# Altium project Power_BMS_Rocket.PrjPcb
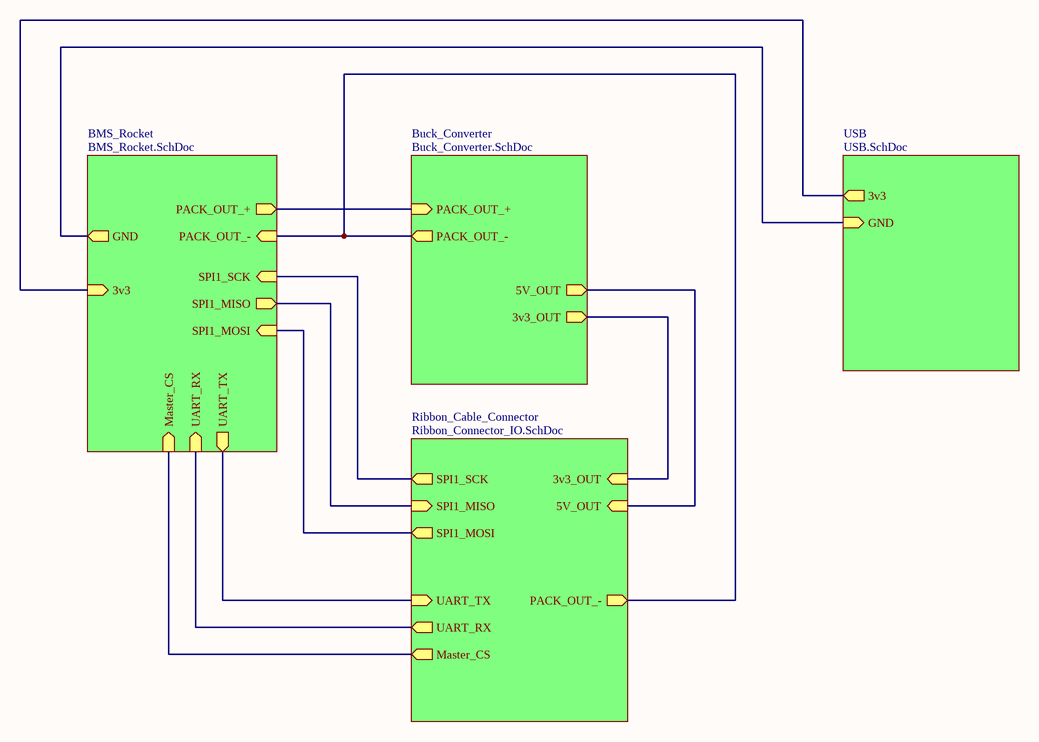
[diagram p0: root.SchDoc]
CAGE_CODE: ?????; CONTRACT_NUMBER: <CONTRACT NO>; DOC_NO_ASSY_DWG: <ASSY DWG NO>; DOC_NO_BOM: <BOM DOC NO>; DOC_NO_FAB_DWG: <FAB DWG NO>; DOC_NO_SCH_DWG: <SCH DWG NO>; PCB_2_DEC_TOL: +/-.01; PCB_3_DEC_TOL: +/-.010; PCB_ANG_TOL: +/-1/2; PCB_ASSEMBLY_NO: <PCB ASSY NO>; PCB_CHECKER: - -----; PCB_CHECKER_APP_DATE: --/--/----; PCB_DESIGNER: - -----; PCB_DESIGNER_APP_DATE: --/--/----; PCB_DWG_NO: <PCB DWG NO>; PCB_ENGINEER: - -----; PCB_ENGINEER_APP_DATE: --/--/----; PCB_PART_NUMBER: <PCB PN>; PCB_REV: A; SCH_REV: A
5 sheets, 97 parts. Net scope: hierarchical (ports join the sheet entries above them; power ports are global).
Board file: Power_BMS.PcbDoc
Sheets:
  root.SchDoc
    BMS_Rocket = BMS_Rocket.SchDoc
    Buck_Converter = Buck_Converter.SchDoc
    Ribbon_Cable_Connector = Ribbon_Connector_IO.SchDoc
    USB = USB.SchDoc

## Sheet root.SchDoc
size A4; SheetNumber: 1; SheetTotal: 5

### Sub-sheets
BMS_Rocket = BMS_Rocket.SchDoc: PACK_OUT_+ (out), PACK_OUT_- (in), SPI1_SCK (in), SPI1_MISO (out), SPI1_MOSI (in), UART_RX (in), UART_TX (out), Master_CS (in), GND (out), 3v3 (in)
Buck_Converter = Buck_Converter.SchDoc: PACK_OUT_- (out), PACK_OUT_+ (in), 3v3_OUT (out), 5V_OUT (out)
Ribbon_Cable_Connector = Ribbon_Connector_IO.SchDoc: SPI1_SCK (out), SPI1_MISO (in), SPI1_MOSI (out), 3v3_OUT (in), 5V_OUT (in), UART_RX (out), UART_TX (in), PACK_OUT_- (out), Master_CS (out)
USB = USB.SchDoc: 3v3 (out), GND (in)

### Nets
+3V3: sheet BMS_Rocket/3v3, sheet USB/3v3
GND: sheet BMS_Rocket/GND, sheet USB/GND
Pack-: sheet BMS_Rocket/PACK_OUT_-, sheet Buck_Converter/PACK_OUT_-, sheet Ribbon_Cable_Connector/PACK_OUT_-
VIN: sheet BMS_Rocket/PACK_OUT_+, sheet Buck_Converter/PACK_OUT_+
3v3_OUT: sheet Buck_Converter/3v3_OUT, sheet Ribbon_Cable_Connector/3v3_OUT
5V_OUT: sheet Buck_Converter/5V_OUT, sheet Ribbon_Cable_Connector/5V_OUT
Master_CS: sheet BMS_Rocket/Master_CS, sheet Ribbon_Cable_Connector/Master_CS
SPI1_CLK: sheet BMS_Rocket/SPI1_SCK, sheet Ribbon_Cable_Connector/SPI1_SCK
SPI1_MISO: sheet BMS_Rocket/SPI1_MISO, sheet Ribbon_Cable_Connector/SPI1_MISO
SPI1_MOSI: sheet BMS_Rocket/SPI1_MOSI, sheet Ribbon_Cable_Connector/SPI1_MOSI
UART_RX: sheet BMS_Rocket/UART_RX, sheet Ribbon_Cable_Connector/UART_RX
UART_TX: sheet BMS_Rocket/UART_TX, sheet Ribbon_Cable_Connector/UART_TX

## Sheet BMS_Rocket.SchDoc
size 431 x 279 mm; SheetNumber: 2; SheetTotal: 5; ENG_APP_DATE: --/--/--; DSN_APP_DATE: --/--/--; CHK_APP_DATE: --/--/--
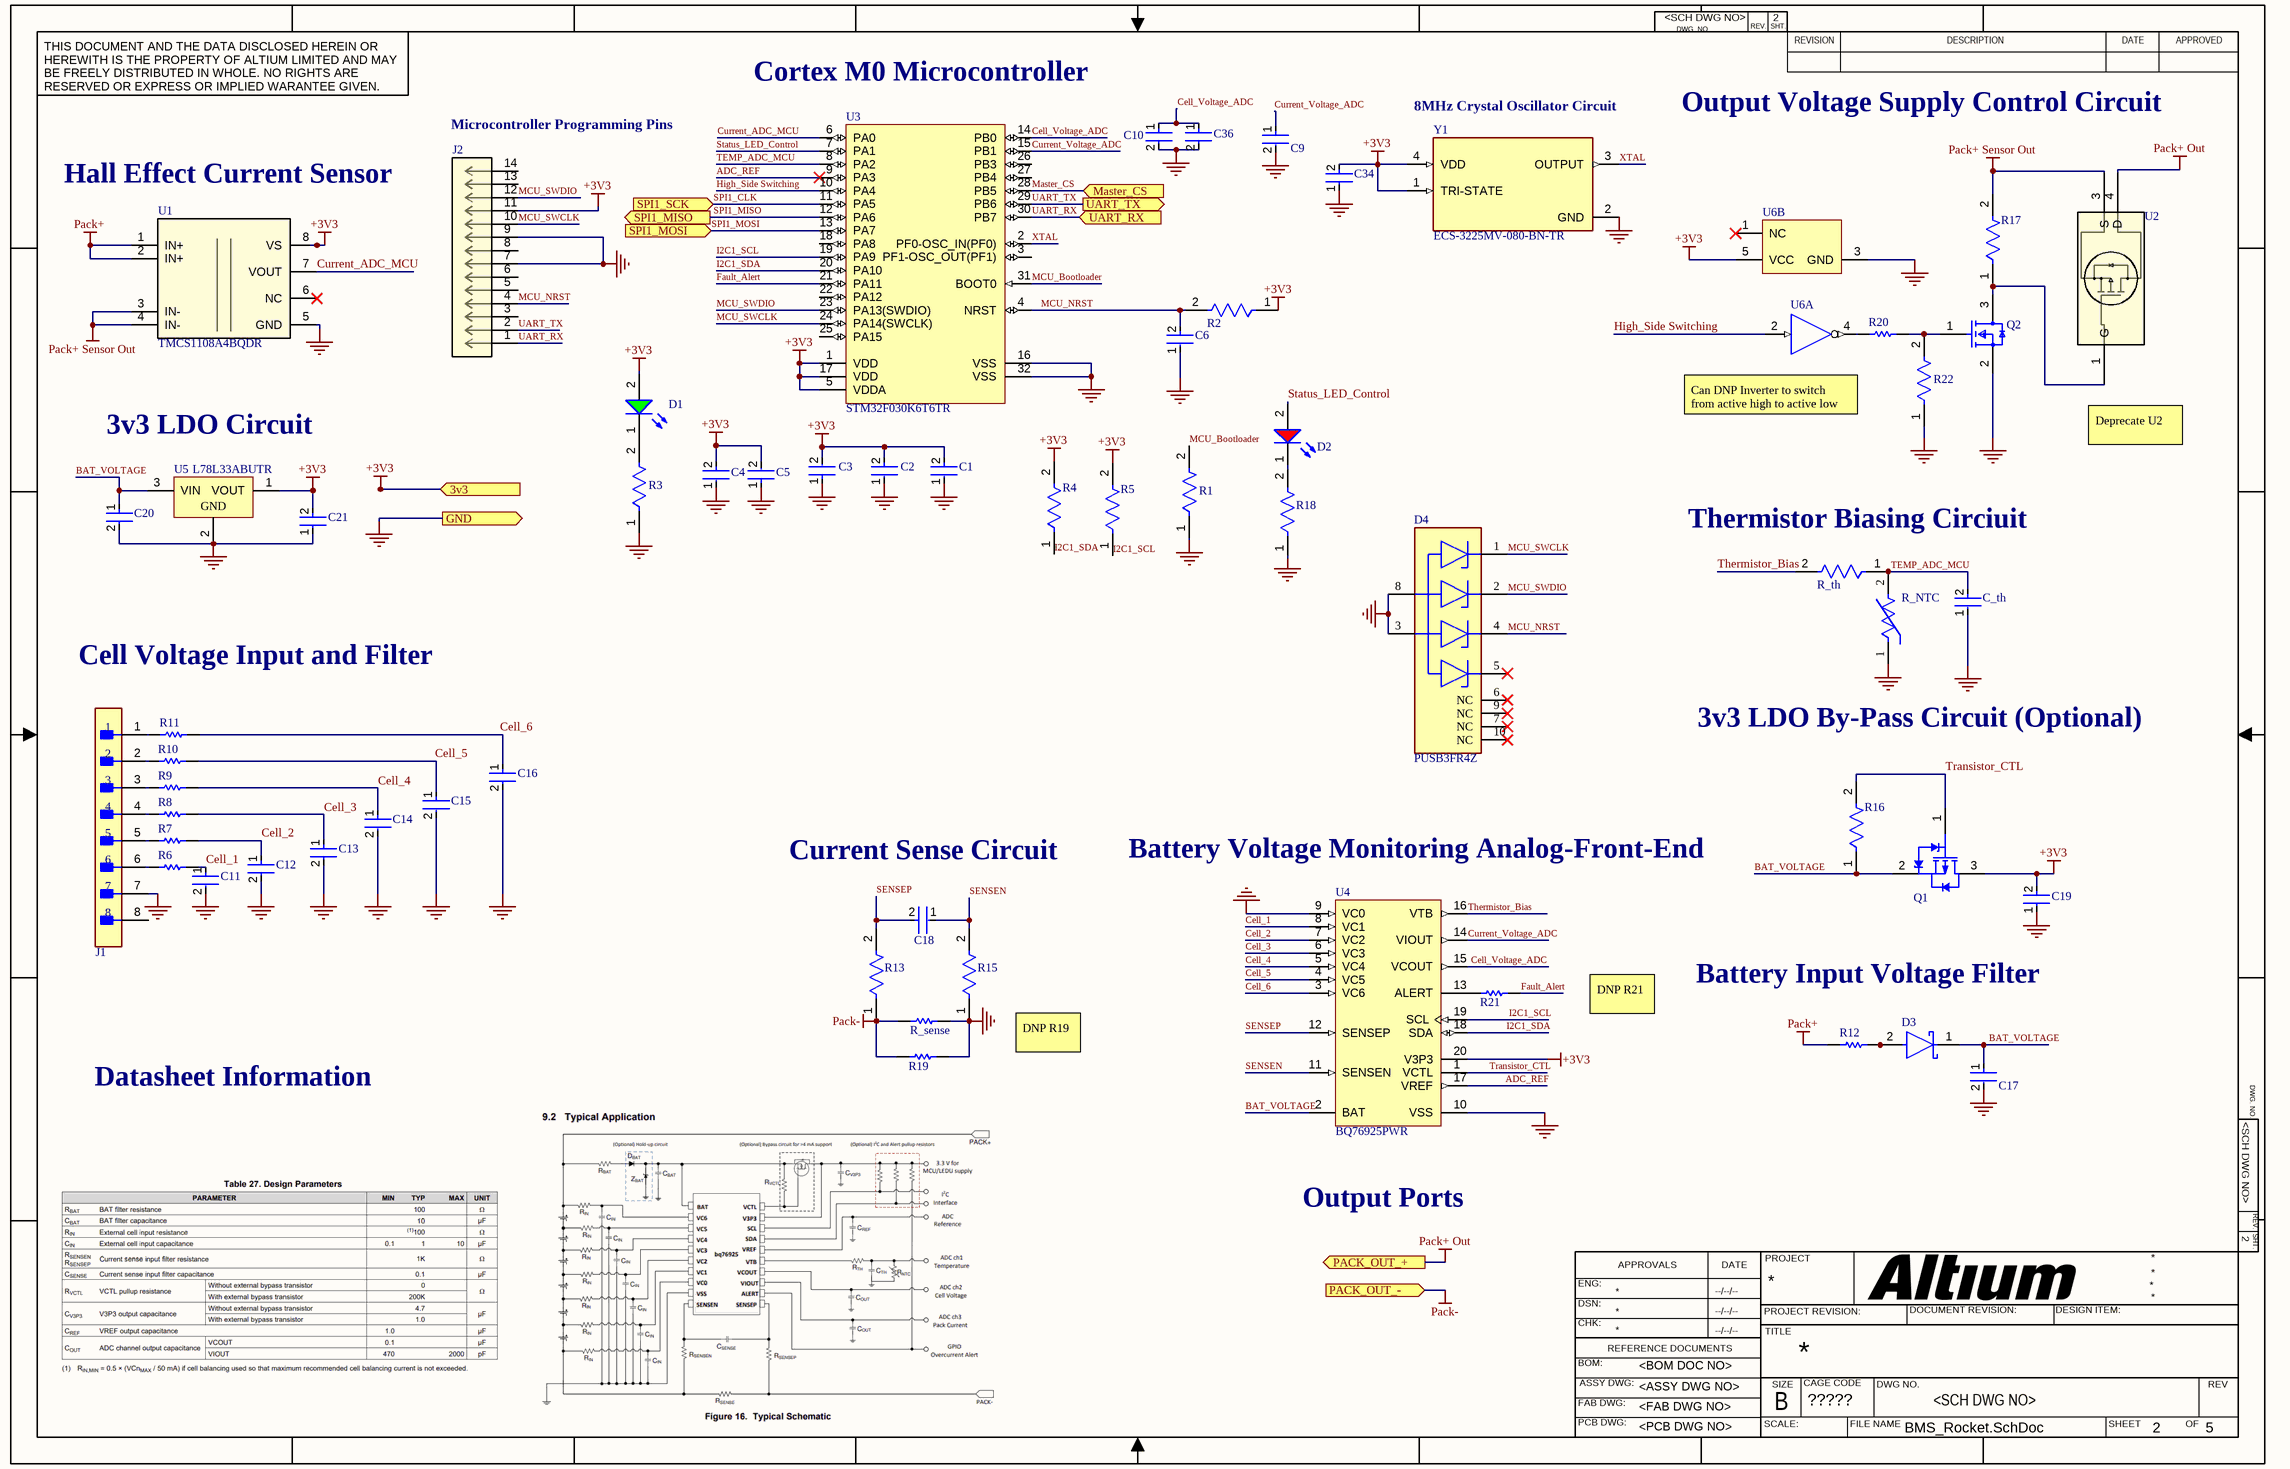
[diagram p1: BMS_Rocket.SchDoc]

### Parts
C1  GRM155R71C104KA88D  [FP-GRM15-MFG]  (value not drawn)
C2  GRM155R71C104KA88D  [FP-GRM15-MFG]  (value not drawn)
C3  GRM188R6YA475KE15D  [FP-GRM188-0_2-IPC_C]  (value not drawn)
C4  C1608X5R1H105K080AB  [FP-C1608-080-0_1-IPC_B]  (value not drawn)
C5  CC0603KRX7R9BB103  [FP-CC0603-DA-MFG]  (value not drawn)
C6  GRM155R71C104KA88D  [FP-GRM15-MFG]  (value not drawn)
C9  GRM1885C1H202JA01D  [FP-GRM188-0_1-e0_2_0_5-IPC_B]  (value not drawn)
C10  CC0402KRX7R8BB102  [FP-CC0402-MFG]  (value not drawn)
C11  UMK107AB7105KA-T  [FP-0603-L_1_6_0_15-W_0_8-IPC_C]  (value not drawn)
C12  UMK107AB7105KA-T  [FP-0603-L_1_6_0_15-W_0_8-IPC_C]  (value not drawn)
C13  UMK107AB7105KA-T  [FP-0603-L_1_6_0_15-W_0_8-IPC_C]  (value not drawn)
C14  UMK107AB7105KA-T  [FP-0603-L_1_6_0_15-W_0_8-IPC_C]  (value not drawn)
C15  UMK107AB7105KA-T  [FP-0603-L_1_6_0_15-W_0_8-IPC_C]  (value not drawn)
C16  UMK107AB7105KA-T  [FP-0603-L_1_6_0_15-W_0_8-IPC_C]  (value not drawn)
C17  C3216X5R1H106M160AB  [FP-C3216-160-0_2-MFG]  (value not drawn)
C18  GRM155R71C104KA88D  [FP-GRM15-MFG]  (value not drawn)
C19  C1608X5R1H105K080AB  [FP-C1608-080-0_1-IPC_B]  (value not drawn)
C20  CGA3E3X7R1H334K080AB  [FP-CGA3E-0_3-0_1-IPC_B]  (value not drawn)
C21  GRM155R71C104KA88D  [FP-GRM15-MFG]  (value not drawn)
C34  GRM155R71C104KA88D  [FP-GRM15-MFG]  (value not drawn)
C36  CC0402KRX7R8BB102  [FP-CC0402-MFG]  (value not drawn)
C_th  GRM155R71C104KA88D  [FP-GRM15-MFG]  (value not drawn)
D1  150060VS75000  [WL-SMCW_0603_150060xx75000]  (value not drawn)
D2  150060SS75000  [WL-SMCW_0603_150060xx75000]  (value not drawn)
D3  B0520LW-7-F  [FP-SOD123-MFG]  (value not drawn)
D4  PUSB3FR4Z  [FP-SOT1176-1-MFG]
J1  M20-9990846  [FP-M20-9990846-MFG]  (value not drawn)
J2  3220-14-0100-00  [CONN14_3220-14_CNC]  (value not drawn)
Q1  BSS84AK,215  [NXP-SOT23_N]  (value not drawn)
Q2  2N7002-7-F  [FP-SOT23-MFG]  (value not drawn)
R1  RC0603FR-0710KL  [FP-RC0603-0_55-IPC_C]  (value not drawn)
R2  RC0603FR-0710KL  [FP-RC0603-0_55-IPC_C]  (value not drawn)
R3  RC0603FR-0710KL  [FP-RC0603-0_55-IPC_C]  (value not drawn)
R4  CRCW06034K70FKEA  [FP-CRCW0603-e3-IPC_A]  (value not drawn)
R5  CRCW06034K70FKEA  [FP-CRCW0603-e3-IPC_A]  (value not drawn)
R6  CRCW0603100RFKEA  [RESC1609X50X30ML8T20]  (value not drawn)
R7  CRCW0603100RFKEA  [RESC1609X50X30ML8T20]  (value not drawn)
R8  CRCW0603100RFKEA  [RESC1609X50X30ML8T20]  (value not drawn)
R9  CRCW0603100RFKEA  [RESC1609X50X30ML8T20]  (value not drawn)
R10  CRCW0603100RFKEA  [RESC1609X50X30ML8T20]  (value not drawn)
R11  CRCW0603100RFKEA  [RESC1609X50X30ML8T20]  (value not drawn)
R12  RK73B1JTTD111J  [RESC1608X55X30NL20T10]  (value not drawn)
R13  AC0603FR-071KL  [FP-AC0603-IPC_B]  (value not drawn)
R15  AC0603FR-071KL  [FP-AC0603-IPC_B]  (value not drawn)
R16  CRCW0603200KFKEA  [FP-CRCW0603-e3-IPC_C]  (value not drawn)
R17  CRCW0603200KFKEA  [FP-CRCW0603-e3-IPC_C]  (value not drawn)
R18  RC0603FR-0710KL  [FP-RC0603-0_55-IPC_C]  (value not drawn)
R19  RC0603JR-070RL  [RESC1608X55X25ML10T15]  (value not drawn)
R20  RK73B1JTTD111J  [RESC1608X55X30NL20T10]  (value not drawn)
R21  RC0603JR-070RL  [RESC1608X55X25ML10T15]  (value not drawn)
R22  RC0603FR-0710KL  [FP-RC0603-0_55-IPC_C]  (value not drawn)
R_NTC  ERT-J1VG103FA  [FP-ERTJ1-MFG]  (value not drawn)
R_sense  RL1220S-R15-F  [RESC2013X50X40LL20T20]  (value not drawn)
R_th  RC0603FR-0710KL  [FP-RC0603-0_55-IPC_C]  (value not drawn)
U1  TMCS1108A4BQDR  [D0008A-IPC_A]
U2  FQD11P06TM  [TO-252-3_ONS]  (value not drawn)
U3  STM32F030K6T6TR  [STM-LQFP32_M]
U4  BQ76925PWR  [PW0020A_L]
U5  L78L33ABUTR  [SOT-89_N]
U6  SN74LVC1G04DCKR  [DCK0005A_N]  (value not drawn)  (parts A,B of 2)
Y1  ECS-3225MV-080-BN-TR  [OSC_ECS-3225MV-080-BN-TR]

### Ports
3v3 (in), GND (out), Master_CS (in), PACK_OUT_+ (out), PACK_OUT_- (in), SPI1_MISO (out), SPI1_MOSI (in), SPI1_SCK (in), UART_RX (in), UART_TX (out)

### Nets
+3V3: C1.2 C2.2 C3.2 C4.2 C5.2 C19.2 C21.2 C34.2 D1.2(A) J2.11 Q1.3(D) R2.1 R4.2 R5.2 U1.8(VS) U3.1(VDD) U3.5(VDDA) U3.17(VDD) U4.20(V3P3) U5.1(VOUT) U6.5(VCC) Y1.1(TRI-STATE) Y1.4(VDD) ; port 3v3
GND: C1.1 C2.1 C3.1 C4.1 C5.1 C6.1 C9.2 C10.2 C11.2 C12.2 C13.2 C14.2 C15.2 C16.2 C17.2 C19.1 C20.2 C21.1 C34.1 C36.2 C_th.1 D4.3(GND) D4.8(GND) J1.7 J2.7 J2.9 Q2.2(S) R1.1 R3.1 R15.1 R18.1 R19.1 R22.1 R_NTC.1 R_sense.1 U1.5(GND) U3.16(VSS) U3.32(VSS) U4.9(VC0) U4.10(VSS) U5.2(GND) U6.3(GND) Y1.2(GND) ; port GND
Pack+: R12.1 U1.1(IN+) U1.2(IN+)
Pack+ Out: U2.4(D) ; port PACK_OUT_+  [project net VIN]
Pack+ Sensor Out: R17.2 U1.3(IN-) U1.4(IN-) U2.3(S)
Pack-: R13.1 R19.2 R_sense.2 ; port PACK_OUT_-
ADC_REF: U3.9(PA3) U4.17(VREF)
BAT_VOLTAGE: C17.1 C20.1 D3.1(C) Q1.2(S) R16.1 U4.2(BAT) U5.3(VIN)
Cell_1: C11.1 R6.2 U4.8(VC1)
Cell_2: C12.1 R7.2 U4.7(VC2)
Cell_3: C13.1 R8.2 U4.6(VC3)
Cell_4: C14.1 R9.2 U4.5(VC4)
Cell_5: C15.1 R10.2 U4.4(VC5)
Cell_6: C16.1 R11.2 U4.3(VC6)
Cell_Voltage_ADC: C10.1 C36.1 U3.14(PB0) U4.15(VCOUT)
Current_ADC_MCU: U1.7(VOUT) U3.6(PA0)
Current_Voltage_ADC: C9.1 U3.15(PB1) U4.14(VIOUT)
Fault_Alert: R21.1 U3.21(PA11)
High_Side Switching: U3.10(PA4) U6.2(A)
I2C1_SCL: R5.1 U3.19(PA9) U4.19(SCL)
I2C1_SDA: R4.1 U3.20(PA10) U4.18(SDA)
Master_CS: U3.28(PB5) ; port Master_CS
MCU_Bootloader: R1.2 U3.31(BOOT0)
MCU_NRST: C6.2 D4.4(CH3) J2.4 R2.2 U3.4(NRST)
MCU_SWCLK: D4.1(CH1) J2.10 U3.24(PA14(SWCLK))
MCU_SWDIO: D4.2(CH2) J2.12 U3.23(PA13(SWDIO))
SENSEN: C18.1 R15.2 U4.11(SENSEN)
SENSEP: C18.2 R13.2 U4.12(SENSEP)
SPI1_CLK: U3.11(PA5) ; port SPI1_SCK
SPI1_MISO: U3.12(PA6) ; port SPI1_MISO
SPI1_MOSI: U3.13(PA7) ; port SPI1_MOSI
Status_LED_Control: D2.2(A) U3.7(PA1)
TEMP_ADC_MCU: C_th.2 R_NTC.2 R_th.1 U3.8(PA2)
Thermistor_Bias: R_th.2 U4.16(VTB)
Transistor_CTL: Q1.1(G) R16.2 U4.1(VCTL)
UART_RX: J2.1 U3.30(PB7) ; port UART_RX
UART_TX: J2.2 U3.29(PB6) ; port UART_TX
XTAL: U3.2(PF0-OSC_IN(PF0)) Y1.3(OUTPUT)
NetD1_1: D1.1(K) R3.2
NetD2_1: D2.1(K) R18.2
NetD3_2: D3.2(A) R12.2
NetJ1_1: J1.1 R11.1
NetJ1_2: J1.2 R10.1
NetJ1_3: J1.3 R9.1
NetJ1_4: J1.4 R8.1
NetJ1_5: J1.5 R7.1
NetJ1_6: J1.6 R6.1
NetQ2_1: Q2.1(G) R20.2 R22.2
NetQ2_3: Q2.3(D) R17.1 U2.1(G)
NetR20_1: R20.1 U6.4(Y)
NetR21_2: R21.2 U4.13(ALERT)

Not connected (* = marked no-connect by the designer): D4 5(CH4)* 6(NC)* 7(NC)* 9(NC)* 10(NC)*; J1 8; J2 3 5 6 8 13 14; U1 6(NC)*; U3 3(PF1-OSC_OUT(PF1)) 18(PA8) 22(PA12) 25(PA15) 26(PB3) 27(PB4); U6 1(NC)*

### Notes on the sheet
- Cortex M0 Microcontroller
- (near J2) Microcontroller Programming Pins
- (near Y1) 8MHz Crystal Oscillator Circuit
- Output Voltage Supply Control Circuit
- Hall Effect Current Sensor
- Can DNP Inverter to switch from active high to active low
- 3v3 LDO Circuit
- Deprecate U2
- (near R_th) Thermistor Biasing Circiuit
- Cell Voltage Input and Filter
- 3v3 LDO By-Pass Circuit (Optional)
- Current Sense Circuit
- (near U4) Battery Voltage Monitoring Analog-Front-End
- DNP R21
- Battery Input Voltage Filter
- Datasheet Information
- DNP R19
- Output Ports
- DWG. NO.
- REV.
- SHT.
- THIS DOCUMENT AND THE DATA DISCLOSED HEREIN OR HEREWITH IS THE PROPERTY OF ALTIUM LIMITED AND MAY BE FREELY DISTRIBUTED IN WHOLE. NO RIGHTS ARE RESERVED OR EXPRESS OR IMPLIED WARANTEE GIVEN.
- REVISION
- DESCRIPTION
- DATE
- APPROVED
- ENG:
- APPROVALS
- PROJECT
- DSN:
- CHK:
- REFERENCE DOCUMENTS
- PROJECT REVISION:
- TITLE
- DOCUMENT REVISION:
- DESIGN ITEM:
- BOM:
- FAB DWG:
- PCB DWG:
- ASSY DWG:
- SCALE:
- SIZE
- B
- CAGE CODE
- FILE NAME
- DWG NO.
- SHEET
- OF
- REV

### Library data of the parts
C1 C2 C6 C18 C21 C34 = CMP-2100-03641-2: CAP CER 0.1UF 16V X7R 0402; Manufacturer: Murata; Standoff Height: 0mm; Tolerance: 10%; Voltage Rating: 16Vdc; Material: Ceramic; Capacitance: 0.10μF; Value: 0.10μF; RoHS: TRUE; Manufacturer Part Number: GRM155R71C104KA88D; Temperature Characteristic: X7R; Octopart: https://octopart.com/grm155r71c104ka88d-murata-196880; Digikey Description: CAP CER 0.1UF 16V X7R 0402; Device Class L3: Ceramic Capacitors; Height: 0.55mm; ComponentLink2Description: Datasheet; Temperature Range Low: -55°C; Ipc Land Pattern Name: CAPC10050X219; ComponentLink2URL: https://search.murata.co.jp/Ceramy/image/img/A01X/G101/ENG/GRM155R71H471KA01-01A.pdf; Device Class L1: Passive Components; Lead Free: yes; Category: Cap; Package: GRM15; Temperature: -55°C to +125°C; Device Class L2: Capacitors; Temperature Range High: +125°C; Mouser Description: 0402 0.1 uF 16V ±10 % Tolerance X7R SMT Multilayer Ceramic Capacitor
C3 = CMP-2006-02545-2: Chip Multilayer Ceramic Capacitors for General Purpose, 0603, 4.7uF, X5R, 15%, 10%, 35V; Lead Free: Lead Free; Max Operating Temperature: 85°C; Case Code (Imperial): 0603; Capacitance: 4.7uF; Width: 0.8mm; Thickness: 0.031inch; Case Code (Metric): 1608; Min Operating Temperature: -55°C; Voltage Rating (DC): 35V; Dielectric: X5R; Voltage: 35V; Packaging: Tape and Reel; Resistor Type: Ceramic; Weight: 0.000222oz; Mount: Surface Mount; Material: Ceramic; Depth: 0.8mm; Tolerance: 10%; REACH SVHC: No SVHC; Case/Package: 0603; Voltage Rating: 35V; Package Quantity: 4000; Height: 0.8mm; Length: 1.6mm; Termination: SMD/SMT
C4 C19 = CMP-2000-06025-2: Multilayer Ceramic Capacitors 1μF ±10% 50V X5R SMD 0603; Capacitance: 1uF; Lead Free: Lead Free; Height: 0.8mm; Mount: Surface Mount; Radiation Hardening: No; Thickness: 0.035inch; Length: 1.6mm; Max Operating Temperature: 85°C; REACH SVHC: No SVHC; Min Operating Temperature: -55°C; Construction: Flat; RoHS Compliant: Yes; Voltage Rating: 50V; Dielectric: X5R; Packaging: Tape and Reel; Termination: SMD/SMT; Voltage Rating (DC): 50V; Case Code (Imperial): 0603; Voltage: 50V; Width: 0.031inch; Weight: 7.1E-05oz; Depth: 0.8mm; Case Code (Metric): 1608; Series: C; Case/Package: 0603; Tolerance: 10%; Resistor Type: Ceramic; Number of Pins: 2; Dielectric Material: Ceramic; Package Quantity: 1
C5 = CMP-2100-03600-2: CAP CER 10000PF 50V X7R 0603; Manufacturer: YAGEO; Tolerance: 0.1; Material: Ceramic; Temperature Coefficient: 15%; Value: 10 nF; Mouser Description: Multilayer Ceramic Capacitor, CC Series, 0.01 - F, - 10%, X7R, 50 V, 0603 [1608 Metric]; Digikey Description: CAP CER 10000PF 50V X7R 0603; Height: 0.9mm; Category: Cap; Temperature Characteristic: X7R; Footprint Url: http://www.yageo.com/exep/pages/download/literatures/UPY-C_GEN_24.pdf; Lead Free: Yes; Voltage Rating: 50 V; Manufacturer Part Number: CC0603KRX7R9BB103; Temperature: -55°C to +125°C; Device Class L3: Ceramic Capacitors; ComponentLink2Description: Datasheet; Voltage: 50 V; Package: CC0603-DA; Octopart: https://octopart.com/cc0603krx7r9bb103-yageo-192938; Automotive: No; Temperature Range High: +125°C; Temperature Range Low: -55°C; RoHS: TRUE; Device Class L1: Passive Components; ComponentLink2URL: http://www.yageo.com/documents/recent/UPY-GPHC_X7R_6.3V-to-50V_18.pdf; Device Class L2: Capacitors; Capacitance: 10 nF
C9 = CMP-2006-02494-2: Chip Multilayer Ceramic Capacitors for General Purpose, 0603, 2000pF, C0G, 30ppm/°C, 5%, 50V; Capacitance: 2nF; Voltage Rating (DC): 50V; Depth: 0.8mm; Material: Ceramic; Package Quantity: 1; Packaging: Tape and Reel; Case Code (Imperial): 0603; Termination: SMD/SMT; Min Operating Temperature: -55°C; Dielectric: C0G; Tolerance: 5%; Case/Package: 0603; REACH SVHC: No SVHC; Max Operating Temperature: 125°C; Length: 1.6mm; Case Code (Metric): 1608; Voltage: 50V; Lead Free: Lead Free; Thickness: 0.035inch; Height: 0.8mm; Mount: Surface Mount; Radiation Hardening: No; Voltage Rating: 50V; Width: 0.8mm
C10 C36 = CMP-03422-000989-1: CAP CER 1000PF 25V X7R 0402; Manufacturer: YAGEO; Material: Ceramic; Value: 1.0 nF; Temperature Coefficient: 30ppm/°C; Automotive Grade: NA; Tolerance: 0.1; Voltage Rating: 25 V; Automotive: No; Temperature Range High: +125°C; ComponentLink2Description: Datasheet; Device Class L2: Capacitors; Device Class L3: Ceramic Capacitors; Mouser Description: Multilayer Ceramic Capacitors MLCC - SMD/SMT 1.0nF 25V X7R 10%; Digikey Description: CAP CER 1000PF 25V X7R 0402; Package: CC0402; Manufacturer Part Number: CC0402KRX7R8BB102; Octopart: https://octopart.com/cc0402krx7r8bb102-yageo-12885104; Temperature Range Low: -55°C; Device Class L1: Passive Components; Lead Free: Yes; RoHS: TRUE; ComponentLink2URL: http://www.yageo.com/documents/recent/UPY-GP_NP0_16V-to-50V_16.pdf; Temperature Characteristic: X7R; Temperature: -55°C to +125°C; Category: Cap; Footprint Url: http://www.yageo.com/exep/pages/download/literatures/UPY-C_GEN_24.pdf; Height: 0.55mm; Ipc Land Pattern Name: CAPC10050X50; Capacitance: 1.0 nF
C11-C16 = CMP-2000-07531-4: Ceramic Capacitor General Use 1uF ±10% 50V X7R 0603; Series: M; Width: 0.031inch; Mount: Surface Mount; Radiation Hardening: No; Voltage Rating (DC): 50V; Packaging: Tape and Reel; Termination: SMD/SMT; Depth: 0.8mm; Case Code (Metric): 1608; Case Code (Imperial): 0603; Height: 0.8mm; Voltage Rating: 50V; Package Quantity: 1; Halogen Free: Halogen Free; Dielectric: X7R; Min Operating Temperature: -55°C; Length: 1.6mm; Construction: Flat; Tolerance: 10%; Thickness: 0.037inch; Max Operating Temperature: 125°C; Case/Package: 0603; Capacitance: 1uF; RoHS Compliant: Yes
C17 = CMP-08246-006999-1: Multilayer Ceramic Capacitors 10uF ±20% 50V X5R SMD 1206; Depth: 1.6mm; Lead Free: Lead Free; Case Code (Metric): 3216; Tolerance: 20%; Thickness: 0.071inch; REACH SVHC: No SVHC; Capacitance: 10uF; Height: 1.6mm; Length: 3.2mm; Voltage Rating: 50V; Dielectric: X5R; Package Quantity: 1; Series: C; Construction: Flat; Min Operating Temperature: -55°C; Mount: Surface Mount; Case Code (Imperial): 1206; Packaging: Tape and Reel; Radiation Hardening: No; Weight: 0.000571oz; Resistor Type: Ceramic; Voltage Rating (DC): 50V; Dielectric Material: Ceramic; Width: 0.063inch; Max Operating Temperature: 85°C; RoHS Compliant: Yes; Termination: SMD/SMT; Case/Package: 1206
C20 = CMP-08246-003263-1: Cap Ceramic 330nF 50V X7R 10% Pad SMD 0603 +125°C Automotive T/R; Thickness: 0.035inch; Package Quantity: 4000; Weight: 7.1E-05oz; Dielectric: X7R; Height: 0.8mm; Termination: SMD/SMT; Voltage Rating (DC): 50V; Length: 0.063inch; Packaging: Tape and Reel; Width: 0.031inch; Ratings: AEC-Q200; Tolerance: 10%; Min Operating Temperature: -55°C; Capacitance: 330nF; Max Operating Temperature: 125°C; Voltage Rating: 50V; Mount: Surface Mount; RoHS Compliant: Yes; Case Code (Imperial): 0603; Case/Package: 0603; Case Code (Metric): 1608
C_th = CMP-2100-03641-2: CAP CER 0.1UF 16V X7R 0402; Manufacturer: Murata; Standoff Height: 0mm; Tolerance: 10%; Voltage Rating: 16Vdc; Capacitance: 0.10μF; Value: 0.10μF; RoHS: TRUE; Manufacturer Part Number: GRM155R71C104KA88D; Temperature Characteristic: X7R; Octopart: https://octopart.com/grm155r71c104ka88d-murata-196880; Digikey Description: CAP CER 0.1UF 16V X7R 0402; Device Class L3: Ceramic Capacitors; Height: 0.55mm; ComponentLink2Description: Datasheet; Temperature Range Low: -55°C; Ipc Land Pattern Name: CAPC10050X219; ComponentLink2URL: https://search.murata.co.jp/Ceramy/image/img/A01X/G101/ENG/GRM155R71H471KA01-01A.pdf; Device Class L1: Passive Components; Lead Free: yes; Category: Cap; Package: GRM15; Temperature: -55°C to +125°C; Device Class L2: Capacitors; Material: Ceramic; Temperature Range High: +125°C; Mouser Description: 0402 0.1 uF 16V ±10 % Tolerance X7R SMT Multilayer Ceramic Capacitor
D1 = CMP-1426-00006-7: WURTH ELEKTRONIK - 150060VS75000 - LED, Green, SMD, 0603, 30 mA, 2 V, 570 nm; Reverse Voltage: 5V; Power Dissipation: 72mW; Dominant Wavelength: 570nm; Peak Wavelength: 572nm; Forward Current: 100mA; Forward Voltage: 2V; Lens Style: Clear, Rectangular; Test Current: 20mA; Max Junction Temperature (Tj): 95°C; Viewing Angle: 140°; Luminous Intensity: 40mcd; Height: 700µm; Width: 800µm; Length: 1.6mm; Mount: Surface Mount; Min Operating Temperature: -40°C; Max Reverse Voltage (DC): 5V; Case Code (Imperial): 0603; Wavelength: 570nm; Color: Green; REACH SVHC: Unknown; RoHS: Compliant; Max Operating Temperature: 85°C; Packaging: Tape and Reel; Case/Package: 0603; Number of Pins: 2; Case Code (Metric): 1608
D2 = CMP-1426-00004-3: Led, Red, 630 Nm, 1.9 V, 30 Ma, 60 Mcd Rohs Compliant: Yes; Dominant Wavelength: 630nm; Lens Style: Clear, Rectangular; Forward Current: 100mA; Test Current: 20mA; Viewing Angle: 140°; Forward Voltage: 1.9V; Peak Wavelength: 645nm; Max Reverse Voltage (DC): 5V; Luminous Intensity: 60mcd; Color: Red; Height: 700µm; Min Operating Temperature: -40°C; Case Code (Imperial): 0603; REACH SVHC: Unknown; RoHS: Compliant; Length: 1.6mm; Case Code (Metric): 1608; Mount: Surface Mount; Wavelength: 630nm; Packaging: Tape and Reel; Max Operating Temperature: 85°C; Width: 800µm; Case/Package: 0603
D3 = CMP-12790-000026-1: DIODE SCHOTTKY 20V 500MA SOD123; Manufacturer: Diodes Inc.; Max Junction Temp: +125°C; Value: 170pF; Max Surge Forward Current: 5.5A; Forward Current: 0.5A; Standoff Height: 0mm; Peak Reverse Current: 250uA; Octopart: https://octopart.com/b0520lw-7-f-diodes+inc.-325707; Mouser Description: Schottky Diodes & Rectifiers 20V 410mW; ComponentLink2Description: Datasheet; Ipc Land Pattern Name: SOD365155X123-2; Device Class L1: Discrete Semiconductors; Category: Diode; ComponentLink2URL: https://www.diodes.com/assets/Datasheets/ds30051.pdf; Footprint Url: https://www.diodes.com/assets/Package-Files/SOD123.pdf; Package: SOD123; Device Class L3: Schottky Diodes; Digikey Description: DIODE SCHOTTKY 20V 500MA SOD123; Temperature Range Low: -65°C; RoHS: TRUE; Max Repetitive Reverse Voltage: 20V; Lead Free: Yes; Temperature: -65°C to +125°C; Reverse Voltage: 20V; Temperature Range High: +125°C; Capacitance: 170pF; Device Class L2: Diodes; Automotive: No; Height: 1.45mm; Manufacturer Part Number: B0520LW-7-F
D4 = CMP-14432-000005-1: TVS DIODE 3.3VWM 3VC DFN2510A-10; RoHS Compliant: Yes
J1 = CMP-15831-000033-1: CONN HEADER VERT 8POS 2.54MM; Connector Type: Male Pin; Gender: Male; Insulation Resistance: 1GR; Number of Positions: 8; Contact Resistance: 30mR; Current Rating: 3A; Termination: Solder; Case/Package: SIL; RoHS Compliant: Yes; Series: M20; Housing Material: Nylon; Radiation Hardening: No; Package Quantity: 1000; Contact Material: Brass; Contact Plating: Tin; Max Operating Temperature: 105°C; Contact Mating Length: 0.24inch; Depth: 2.54mm; Color: Black; Number of Contacts: 8; Mount: Through Hole; Number of Rows: 1; Packaging: Bulk; Min Operating Temperature: -40°C; Max Current Rating: 3A; REACH SVHC: No SVHC; Pitch: 2.54mm; Housing Color: Black; Orientation: Straight; Length: 20.32mm; Contact Type: Male Pin
J2 = 3220-14-0100-00: No Description Available; Mfr_Name: CNC Tech; Type: Headers, Male Pins; RefDes: RefDes
Q1 = CMP-1259-00086-1: P-Channel Trench MOSFET, -50 V, -0.18 A, -55 to 150 degC, 3-Pin SOT23, Tape and Reel; Manufacturer: NXP Semiconductors; Automotive Qualified: Y; Packing: Tape & Reel; Channel Type: P; VGSth [typ] (V): -1.6; IDM [max] (A): -0.7; Code_JEDEC: TO-236AB; DatasheetVersion: Rev. 1; ID [max] (A): -0.18; Mounting Technology: Surface Mount; ComponentLink3URL: http://www.nxp.com/documents/outline_drawing/sot023_po.pdf; ComponentLink1Description: Manufacturer URL; PackageVersion: 06-03-16, 03/2006; ComponentLink2Description: Datasheet; PackageReference: SOT23; VDS [max] (V): -50; PackageDescription: 3-Pin Small Outline Transistor Package, Body 2.9 x 1.3 mm, Pitch 0.95 mm; ComponentLink2URL: http://www.nxp.com/documents/data_sheet/BSS84AK.pdf; ComponentLink3Description: Package Specification; ComponentLink1URL: http://www.nxp.com/; PartNumber: BSS84AK,215
Q2 = CMP-2000-04929-2: MOSFET N-CH 60V 115MA SOT23-3; Turn-On Delay Time: 7ns; Turn-Off Delay Time: 11ns; Drain to Source Resistance: 7.5R; Rise Time: 3ns; Drain to Source Breakdown Voltage: 70V; Input Capacitance: 50pF; Number of Elements: 1; Power Dissipation: 540mW; Max Power Dissipation: 300mW; Fall Time: 5.6ns; Gate to Source Voltage (Vgs): 20V; Threshold Voltage: 2.5V; Element Configuration: Single; Termination: SMD/SMT; Weight: 0.000282oz; Radiation Hardening: No; Max Operating Temperature: 150°C; On-State Resistance: 7.5R; Mount: Surface Mount; Current Rating: 115mA; Contact Plating: Tin; Lead Free: Lead Free; Min Operating Temperature: -55°C; Number of Pins: 3; REACH SVHC: No SVHC; Drain to Source Voltage (Vdss): 60V; Width: 1.3mm; Package Quantity: 3000; Length: 2.9mm; Case/Package: SOT-23; Number of Channels: 1; Dual Supply Voltage: 60V; Packaging: Tape and Reel; Height: 1mm; Voltage Rating (DC): 60V; Nominal Vgs: 2.5V; Continuous Drain Current (ID): 115mA; Voltage: 60V; Rds On Max: 7.5R
R1-R3 R18 R22 R_th = CMP-2100-03664-2: RES 10K OHM 1% 1/10W 0603; Voltage Rating: 75V; Voltage Rating (DC): 50V; Resistance: 10kR; Power Rating: 100mW; Temperature Coefficient: 100ppm/°C; Depth: 0.8mm; Termination: SMD/SMT; Resistor Type: Thick Film; Series: RC; Construction: Rectangular; Features: Moisture Resistant; Packaging: Tape and Reel; Min Operating Temperature: -55°C; Number of Terminations: 2; Lead Pitch: 0.3mm; RoHS Compliant: Yes; Case/Package: 0603; Resistance Tolerance: 1%; Military Standard: Not; Weight: 7.1E-05oz; Number of Pins: 2; Tolerance: 1%; Length: 1.6mm; Case Code (Imperial): 0603; Lead Free: Lead Free; Width: 0.8mm; Max Power Dissipation: 100mW; Height: 0.45mm; Max Operating Temperature: 155°C; Case Code (Metric): 1608; Size Code: 0603
R4 R5 = CMP-1666-00019-3: RES Thick Film, 4.7kΩ, 1%, 0.1W, 100ppm/°C, 0603; Resistance: 4.7kR; Voltage Rating: 75V; Power Rating: 100mW; Case Code (Metric): 1608; Military Standard: Not; Packaging: Tape and Reel; Termination: SMD/SMT; Temperature Coefficient: 100ppm/°C; Lead Free: Lead Free; Length: 1.55mm; Width: 0.85mm; Height: 0.45mm; Depth: 0.85mm; Weight: 7.1E-05oz; Case Code (Imperial): 0603; Contact Plating: Tin; Case/Package: 0603; Max Operating Temperature: 155°C; Mount: Surface Mount; Tolerance: 1%; Min Operating Temperature: -55°C; Package Quantity: 5000; Voltage Rating (DC): 75V; Composition: Thick Film
R6-R11 = CMP-2000-03824-5: Chip Resistor, 100 Ohm, +/- 1%, 100 mW,-55 to 155 degC, 0603 (1608 Metric), RoHS, Tape and Ree; Manufacturer: Vishay Semiconductor; ComponentLink2URL: http://www.vishay.com/docs/20035/dcrcwe3.pdf; ComponentLink1URL: http://www.vishay.com/; Mounting Technology: Surface Mount; ComponentLink1Description: Manufacturer URL; ComponentLink2Description: Datasheet; PackageDescription: 2-Pin Surface Mount Device, Body 1.575 x 0.85 mm; PackageReference: 0603; DatasheetVersion: 06/2012
R12 R20 = CMP-2000-01856-1: Manufacturer: KOA Speer; Part Number: RK73B1JTTD111J
R13 R15 = CMP-2000-04828-3: RES 1kΩ 1.00% 0.1W 0603; Voltage Rating: 50V; Power Rating: 100mW; Tolerance: 1%; Temperature Coefficient: 100ppm/°C; Resistance: 1kR; Depth: 0.8mm; Case/Package: 0603; Size Code: 0603; Case Code (Metric): 1608; Height: 0.022inch; Series: AC; Width: 0.031inch; Construction: Rectangular; Length: 0.063inch; Case Code (Imperial): 0603; Package Quantity: 1; RoHS Compliant: Yes; Features: Moisture Resistant; Resistor Type: Thick Film; Max Power Dissipation: 100mW; Packaging: Tape and Reel; Termination: SMD/SMT; Ratings: AEC-Q200; Max Operating Temperature: 155°C; Min Operating Temperature: -55°C; Military Standard: Not; Lead Free: Lead Free; Number of Terminations: 2
R16 R17 = CMP-2000-03059-2: RES Thick Film, 200kΩ, 1%, 0.1W, 100ppm/°C, 0603; Resistance: 200kR; Voltage Rating (DC): 75V; Power Rating: 100mW; Termination: SMD/SMT; Depth: 0.85mm; Military Standard: Not; Case Code (Metric): 1608; Composition: Thick Film; Package Quantity: 10; Width: 0.033inch; Voltage Rating: 75V; Features: Automotive AEC-Q200; Max Power Dissipation: 100mW; Height: 0.45mm; Mount: Surface Mount; Max Operating Temperature: 155°C; Weight: 7.1E-05oz; Lead Free: Lead Free; Length: 1.55mm; Radiation Hardening: No; Case/Package: 0603; Packaging: Tape and Reel; Contact Plating: Tin; Min Operating Temperature: -55°C; Working Voltage: 75V; Temperature Coefficient: 100ppm/°C; Case Code (Imperial): 0603; Tolerance: 1%; Number of Terminations: 2
R19 R21 = CMP-2100-03667-1: Chip Resistor, 0 Ohm, +/- 5%, 0.1 W, -55 to 155 degC, 0603 (1608 Metric), RoHS, Tape and Reel; Manufacturer: Yageo; Temperature Coefficient: 200ppm/degreesC; Voltage Rating: 50V; Power Rating: 100mW; Resistance: 0mOhm; Width: 0.8mm; Max Operating Temperature: 155degC; Tolerance: 5%; Package Reference: 0603; Height: 0.45mm; Depth: 0.8mm; Package Description: 2-Pin Surface Mount Device, Body 1.6 x 0.8 mm; Termination: SMD/SMT; Package Quantity: 5000; Case/Package: 0603; Case Code (Imperial): 0603; Radiation Hardening: No; Number of Pins: 2; Length: 1.6mm; Lead Free: LeadFree; Voltage Rating (DC): 50V; Military Standard: Not; Datasheet URL: http://www.yageo.com/NewPortal/yageodocoutput?fileName=/pdf/R-Chip/PYu-RC_Group_51_RoHS_L_5.pdf; Manufacturer URL: http://www.yageo.com/; Packaging: TapeandReel; Case Code (Metric): 1608; Min Operating Temperature: -55degC; Composition: ThickFilm; RoHSCompliant: true; Contact Plating: Tin; Datasheet Version: Rev. 5, 10/2016; REACH SVHC: NoSVHC
R_NTC = CMP-05419-000001-1: THERMISTOR NTC 10KOHM 3380K 0603; Resistance: 10kR; Max Power Dissipation: 100mW; Resistance Tolerance: 1%; Case Code (Imperial): 0603; Height: 0.8mm; Case/Package: 0603; Depth: 0.8mm; Min Operating Temperature: -40°C; Accuracy: 1%; Series: ERT-J; Termination: SMD/SMT; Length: 1.6mm; Number of Pins: 2; Lead Free: Lead Free; Power Rating: 100mW; Package Quantity: 4000; RoHS Compliant: Yes; Max Operating Temperature: 125°C; Width: 800um; REACH SVHC: No SVHC; Packaging: Tape and Reel; Tolerance: 1%; Mount: Surface Mount; Case Code (Metric): 1608; Radiation Hardening: No
R_sense = CMP-2001-03155-1: Manufacturer: Susumu; Part Number: RL1220S-R15-F
U1 = TMCS1108A4BQDR: No Description Available; Mfr_Name: Texas Instruments; TYPE: TYPE; RefDes: RefDes; Supplier 1: Digikey; Supplier Part Number 1: 296-TMCS1108A4BQDRCT-ND
U2 = FQD11P06TM: No Description Available; Mfr_Name: onsemi; RefDes: RefDes; Type: Type
U3 = CMP-0304-00067-2: ARM Cortex-M0 32-bit MCU, 32 KB Flash, 4 KB Internal RAM, 26 I/Os, 32-Pin LQFP, -40 to 85 degC, Tape and Reel; Manufacturer: STMicroelectronics; Operating Frequency(F) (Processor speed) (MHz): 48; I/Os (High Current): 26; FLASH Size (Prog) (kB): 32; Supply Voltage(Vcc) min (V): 2.4; Internal RAM Size (kB): 4; Core: ARM Cortex-M0; Package Reference: LQFP32; Mounting Technology: Surface Mount; ComponentLink2URL: http://www.st.com/st-web-ui/static/active/en/resource/technical/document/datasheet/DM00088500.pdf; ComponentLink1URL: http://www.st.com/; Packing: Tape and Reel; Package Description: 32-Pin Low Profile Quad Flat Package, 7 x 7 mm Body, 0.8 mm Pitch; ComponentLink2Description: Datasheet; ComponentLink1Description: Manufacturer URL; DatasheetVersion: Rev. 2; PartNumber: STM32F030K6T6TR
U4 = CMP-0321-00736-2: Analog Front End for 3 to 6 Series Lithium-Ion Cells, -25 to 85 degC, 20-pin TSSOP (PW), Green (RoHS & no Sb/Br); Manufacturer: Texas Instruments; SubFamily: Lithium Ion Protection; Li-Ion: Y; Lead Acid: N; PackageReference: PW0020A; PackageVersion: revG, Feb-2011; DatasheetVersion: SLUSAM9B; Li-Polymer: Y; PackageDescription: 20-Pin Plastic Thin Small Outline Package 6.5 x 4.4 mm Body ,0.65 mm Pitch; Over Voltage Protection: N; NiCd: N; NiMH: N; PartNumber: BQ76925PWR; Eco-Plan: Green (RoHS & no Sb/Br); Mounting Technology: Surface Mount; ComponentLink1URL: http://www.ti.com/general/docs/lit/getliterature.tsp?genericPartNumber=BQ76925&fileType=pdf; Code_JEDEC: MO-153; ComponentLink1Description: Datasheet
U5 = CMP-0244-00410-1: Positive Voltage Regulator, 3.3V, 4-Pin SOT-89, Tape and Reel; ComponentLink2Description: Datasheet; ComponentLink2URL: http://www.st.com/internet/com/TECHNICAL_RESOURCES/TECHNICAL_LITERATURE/DATASHEET/CD00000446.pdf; DatasheetVersion: 1/02/2011; ComponentLink1Description: Manufacturer URL; PackageVersion: 2011; ComponentLink1URL: http://www.st.com; PackageReference: SOT-89; PackageDescription: 3-Pin SOT-89 Package 1.5 mm Pitch, 4.1 mm Lead Span
U6 = CMP-0859-00252-3: Single Inverter, DCK0005A, LARGE T&R; Manufacturer: Texas Instruments; Input Type: CMOS/TTL; Output Drive (IOL/IOH)(Max)(mA): 32/-32; Sub-Family: Inverting Buffer/Driver; VCC(Min)(V): 1.65; Bits(#): 1; Schmitt Trigger: No; Technology Family: LVC; Rating: Catalog; ICC @ Nom Voltage(Max)(mA): 0.01; tpd @ Nom Voltage(Max)(ns): 7.5,5.2,4.2,3.7; Voltage(Nom)(V): 1.8,2.5,3.3,5; F @ Nom Voltage(Max)(Mhz): 150; Output Type: CMOS; VCC(Max)(V): 5.5; Logic: Inverting; PackageReference: DCK0005A; Generic Part Number: SN74LVC1G04; Operating Temperature Range(C): -40 to 125,-40 to 85; DatasheetVersion: SCES214AD; 3-State Output: No
Y1 = ECS-3225MV-080-BN-TR: 8 MHz XO (Standard) HCMOS Oscillator 1.62V ~ 3.63V Enable/Disable 4-SMD, No Lead; MF: ECS Inc.; SnapEDA_Link: https://www.snapeda.com/parts/ECS-3225MV-080-BN-TR/ECS/view-part/?ref=snap; Package: ECS-3225MV-0-4 ECS; Value: *; MP: ECS-3225MV-080-BN-TR; Check_prices: https://www.snapeda.com/parts/ECS-3225MV-080-BN-TR/ECS/view-part/?ref=eda

## Sheet Buck_Converter.SchDoc
size A4; SheetNumber: 3; SheetTotal: 4
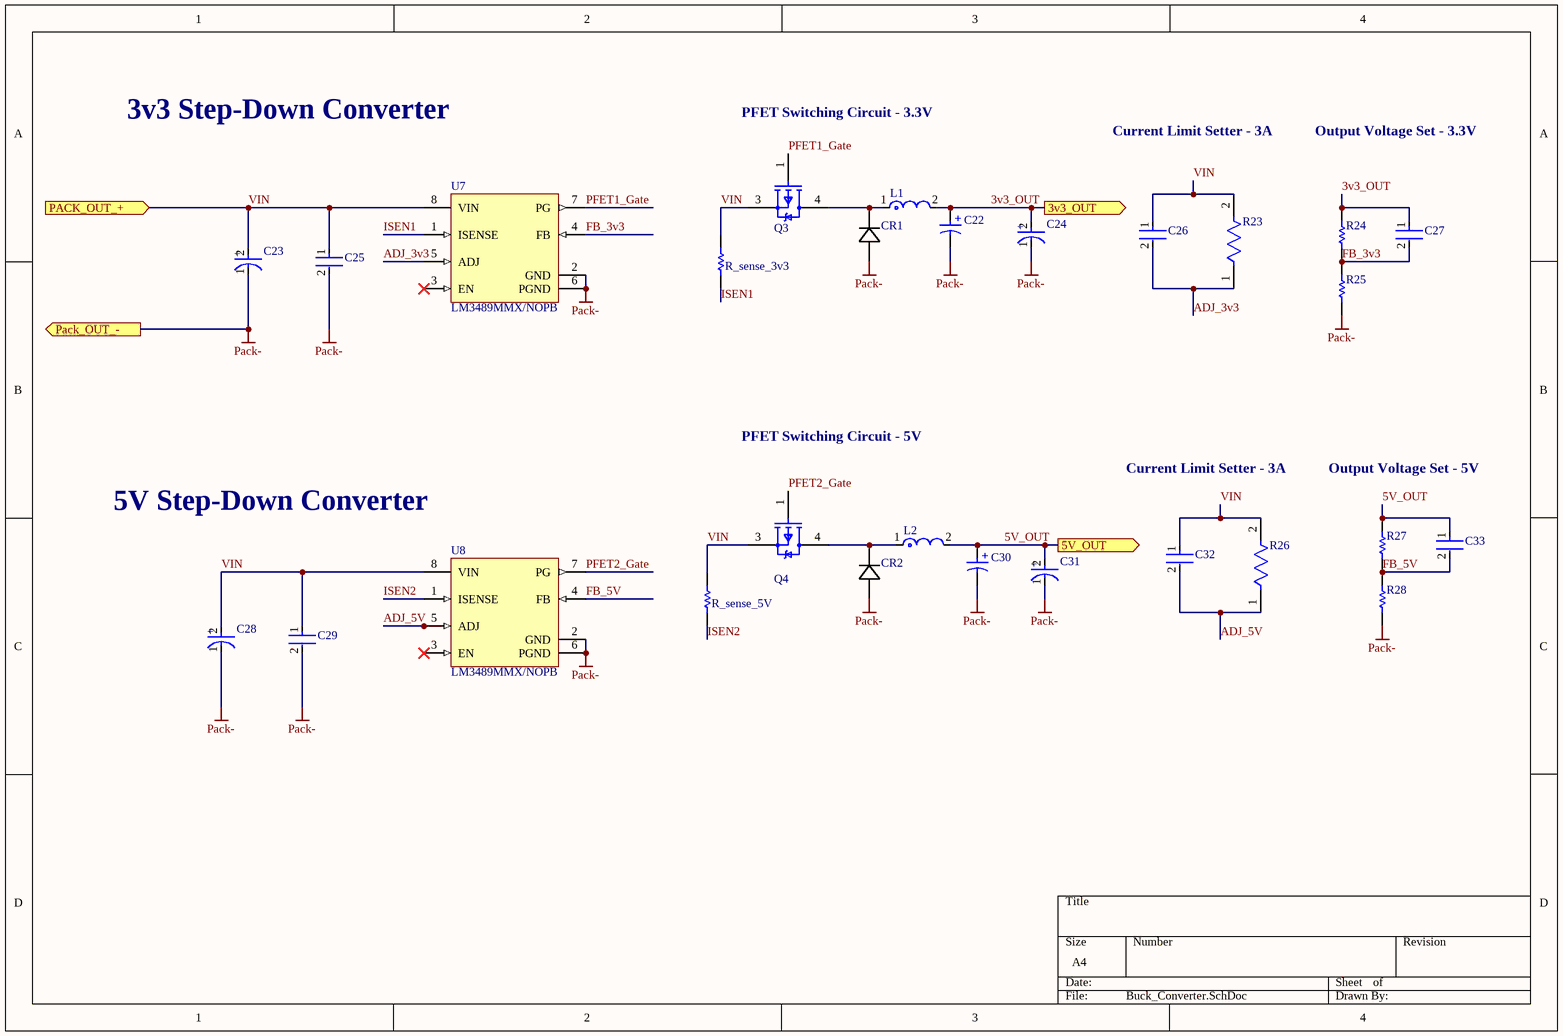
[diagram p2: Buck_Converter.SchDoc]

### Parts
C22  865080545012  [WCAP-ASLI_D6.3H7.7]  (value not drawn)
C23  EEEFK1H220P  [FP-FKD-MFG]  (value not drawn)
C24  EEE-FK1H100UR  [FP-FKC-MFG]  (value not drawn)
C25  C0603C104K5RACTU  [FP-C0603C-CF-MFG]  (value not drawn)
C26  C0603C104M5RACAUTO  [FP-C0603C-CF-MFG]  (value not drawn)
C27  C0603C101J5GACTU  [FP-C0603C-CF-MFG]  (value not drawn)
C28  EEEFK1H220P  [FP-FKD-MFG]  (value not drawn)
C29  C0603C104K5RACTU  [FP-C0603C-CF-MFG]  (value not drawn)
C30  865080545012  [WCAP-ASLI_D6.3H7.7]  (value not drawn)
C31  EEE-FK1H100UR  [FP-FKC-MFG]  (value not drawn)
C32  C0603C104M5RACAUTO  [FP-C0603C-CF-MFG]  (value not drawn)
C33  C0603C101J5GACTU  [FP-C0603C-CF-MFG]  (value not drawn)
CR1  B340AE-13  [CR_SMA_320-340AE_DIO]  (value not drawn)
CR2  B340AE-13  [CR_SMA_320-340AE_DIO]  (value not drawn)
L1  1217AS-H-150M=P3  [FP-DEM8045C-MFG]  (value not drawn)
L2  1217AS-H-150M=P3  [FP-DEM8045C-MFG]  (value not drawn)
Q3  IRFR9024NTRPBF  [FP-PG-TO252-3-MFG]  (value not drawn)
Q4  IRFR9024NTRPBF  [FP-PG-TO252-3-MFG]  (value not drawn)
R23  RMCF0603FT182K  [FP-RMCF0603-MFG]  (value not drawn)
R24  ERA3AEB333V  [RESC1608X55X30ML20T20]  (value not drawn)
R25  ERJ-3EKF2002V  [RESC1608X55X30ML15T15]  (value not drawn)
R26  RMCF0603FT182K  [FP-RMCF0603-MFG]  (value not drawn)
R27  ERA3AEB333V  [RESC1608X55X30ML20T20]  (value not drawn)
R28  CRCW060311K0FKEA  [RESC1609X50X30ML10T20]  (value not drawn)
R_sense_3v3  RL1220S-R15-F  [RESC2013X50X40LL20T20]  (value not drawn)
R_sense_5V  RL1220S-R15-F  [RESC2013X50X40LL20T20]  (value not drawn)
U7  LM3489MMX/NOPB  [DGK0008A_N]
U8  LM3489MMX/NOPB  [DGK0008A_N]

### Ports
3v3_OUT (out), 5V_OUT (out), PACK_OUT_+ (in), Pack_OUT_- (out)

### Nets
Pack-: C22.2(N) C23.1(C) C24.1(C) C25.2 C28.1(C) C29.2 C30.2(N) C31.1(C) CR1.2 CR2.2 R25.1 R28.1 U7.2(GND) U7.6(PGND) U8.2(GND) U8.6(PGND) ; port Pack_OUT_-
VIN: C23.2(A) C25.1 C26.1 C28.2(A) C29.1 C32.1 Q3.3(SOURCE) Q4.3(SOURCE) R23.2 R26.2 R_sense_3v3.1 R_sense_5V.1 U7.8(VIN) U8.8(VIN) ; port PACK_OUT_+
3v3_OUT: C22.1(P) C24.2(A) C27.1 L1.2 R24.2 ; port 3v3_OUT
5V_OUT: C30.1(P) C31.2(A) C33.1 L2.2 R27.2 ; port 5V_OUT
ADJ_3v3: C26.2 R23.1 U7.5(ADJ)
ADJ_5V: C32.2 R26.1 U8.5(ADJ)
FB_3v3: C27.2 R24.1 R25.2 U7.4(FB)
FB_5V: C33.2 R27.1 R28.2 U8.4(FB)
ISEN1: R_sense_3v3.2 U7.1(ISENSE)
ISEN2: R_sense_5V.2 U8.1(ISENSE)
PFET1_Gate: Q3.1(GATE) U7.7(PG)
PFET2_Gate: Q4.1(GATE) U8.7(PG)
NetCR1_1: CR1.1 L1.1 Q3.4(DRAIN)
NetCR2_1: CR2.1 L2.1 Q4.4(DRAIN)

Not connected (* = marked no-connect by the designer): U7 3(EN)*; U8 3(EN)*

### Notes on the sheet
- 3v3 Step-Down Converter
- PFET Switching Circuit - 3.3V
- Current Limit Setter - 3A
- Output Voltage Set - 3.3V
- PFET Switching Circuit - 5V
- 5V Step-Down Converter
- Output Voltage Set - 5V
- (in symbol CMP-2000-06209-2) +
- (in symbol CMP-03913-54202496-1) +
- (in symbol CMP-05427-000030-1) +

### Library data of the parts
C22 C30 = CMP-03913-54202496-1: 865080545012 Cap Aluminum Lytic 100uF 35V 20% (6.3 X 7.7mm) SMD 300mA 2000h 105C T/R; Leakage Current: 35µA; Impedance: 380mΩ; Life (Hours): 2000hours; Capacitance: 100µF; Dissipation Factor: 14%; Insulation Resistance: 1MΩ; ESR (Equivalent Series Resistance): 321.392mΩ; Case/Package: Radial; Packaging: Cut Tape; REACH SVHC: Unknown; Voltage Rating (DC): 35V; Diameter: 6.3mm; Min Operating Temperature: -55°C; Ripple Current: 300mA; Height: 7.7mm; Voltage Rating: 35V; RoHS: Compliant; Width: 6.6mm; Ripple Current (AC): 300mA; NexarPartId: 54202496; Max Operating Temperature: 105°C; Tolerance: 20%; Length: 7.7mm
C23 C28 = CMP-2000-06209-2: CAP ALUM 22UF 20% 50V SMD; Life (Hours): 2000Hour; Ripple Current: 165mA; ESR (Equivalent Series Resistance): 880mR; Dielectric Material: Aluminium; Leakage Current: 3uA; Polarity: Polar; Radiation Hardening: No; Lead Free: Lead Free; Capacitance: 22uF; Package Quantity: 1000; Width: 7.8mm; Length: 5.8mm; Max Operating Temperature: 105°C; Tolerance: 20%; Height - Seated (Max): 0.24inch; Height: 5.8mm; Voltage Rating: 50V; Diameter: 6.3mm; Series: FK; Voltage: 50V; Termination: SMD/SMT; Construction: Cylindrical; Mount: Surface Mount; Number of Pins: 2; Case/Package: Radial; Packaging: Tape and Reel; Ripple Current (AC): 165mA; REACH SVHC: No SVHC; Min Operating Temperature: -55°C; Contact Plating: Tin; Voltage Rating (DC): 50V; RoHS Compliant: Yes; Impedance: 880mR
C24 C31 = CMP-05427-000030-1: CAP ALUM 10UF 20% 50V SMD; Impedance: 1.52R; Ripple Current (AC): 85mA; Life (Hours): 2000Hour; Leakage Current: 3uA; Dielectric Material: Aluminium; Length: 5.8mm; Voltage Rating: 50V; Radiation Hardening: No; Max Operating Temperature: 105°C; REACH SVHC: No SVHC; Tolerance: 20%; RoHS Compliant: Yes; Case/Package: Radial; Height: 5.8mm; Voltage: 50V; Diameter: 5mm; Number of Pins: 2; Ripple Current: 85mA; Series: FK; Lead Free: Lead Free; Width: 6.5mm; ESR (Equivalent Series Resistance): 1.52R; Package Quantity: 1000; Construction: Cylindrical; Voltage Rating (DC): 50V; Packaging: Tape and Reel; Height - Seated (Max): 0.228inch; Contact Plating: Tin; Capacitance: 10uF; Min Operating Temperature: -55°C; Termination: SMD/SMT; Material: Aluminium; Mount: Surface Mount
C25 C29 = CMP-2006-03061-2: CAP CER 0.1UF 50V X7R 0603; Manufacturer: KEMET; Tolerance: 0.1; Temperature Coefficient: 30ppm/°C; Material: Ceramic; Automotive Grade: Grade 1; Value: 0.10 μF; Temperature: -55°C to +125°C; RoHS: TRUE; Temperature Range High: +125°C; Lead Free: Yes; Octopart: https://octopart.com/c0603c104k5ractu-kemet-139244; Digikey Description: CAP CER 0.1UF 50V X7R 0603; Category: Cap; Package: C0603C-CF; ComponentLink2Description: Datasheet; Temperature Range Low: -55°C; Device Class L1: Passive Components; Voltage Rating: 50 V; Automotive: Yes; Device Class L3: Ceramic Capacitors; ComponentLink2URL: https://api.kemet.com/component-edge/download/datasheet/C0603C100J5GACAUTO.pdf; Capacitance: 0.10 μF; Device Class L2: Capacitors; Manufacturer Part Number: C0603C104K5RACTU; Temperature Characteristic: X7R; Height: 0.87mm
C26 C32 = CMP-03020-028971-1: C0603 0.10 μF X7R 30ppm/°C 20.00% 50 V; Manufacturer: KEMET; Voltage Rating: 50 V; Value: 0.10 μF; Tolerance: 0.2; Automotive Grade: Grade 1; Material: Ceramic; Temperature Characteristic: X7R; Temperature Range Low: -55°C; Automotive: Yes; Manufacturer Part Number: C0603C104M5RACAUTO; Mouser Description: Cap Ceramic 0.1uF 50V X7R 20% SMD 0603 125°C Paper T/R; RoHS: TRUE; Device Class L3: Ceramic Capacitors; Temperature Range High: +125°C; ComponentLink2Description: Datasheet; ComponentLink2URL: https://api.kemet.com/component-edge/download/datasheet/C0603C100J5GACAUTO.pdf; Package: C0603C-CF; Device Class L1: Passive Components; Device Class L2: Capacitors; Height: 0.87mm; Temperature: -55°C to +125°C; Octopart: https://octopart.com/c0603c104m5racauto-kemet-75146604; Capacitance: 0.10 μF; Temperature Coefficient: 30ppm/°C; Category: Cap; Lead Free: Yes
C27 C33 = CMP-2006-03408-2: CAP CER 100PF 50V C0G/NP0 0603; Manufacturer: KEMET; Material: Ceramic; Tolerance: 0.05; Automotive Grade: Grade 1; Temperature Coefficient: 30ppm/°C; Temperature Characteristic: C0G; RoHS: TRUE; Temperature Range Low: -55°C; Automotive: Yes; Digikey Description: CAP CER 100PF 50V C0G/NP0 0603; Voltage Rating: 50 V; Lead Free: Yes; Category: Cap; Manufacturer Part Number: C0603C101J5GACTU; Device Class L3: Ceramic Capacitors; Mouser Description: Multilayer Ceramic Capacitor, C Series, 100 Pf, - 5%, C0g / Np0, 50 V, 0603 [1608 Metric] Rohs Compliant: Yes; Value: 100 pF; Device Class L1: Passive Components; Temperature: -55°C to +125°C; ComponentLink2URL: https://api.kemet.com/component-edge/download/datasheet/C0603C100J5GACAUTO.pdf; Temperature Range High: +125°C; ComponentLink2Description: Datasheet; Octopart: https://octopart.com/c0603c101j5gactu-kemet-100052; Device Class L2: Capacitors; Height: 0.87mm; Capacitance: 100 pF; Package: C0603C-CF
CR1 CR2 = B340AE-13: No Description Available; Mfr_Name: Diodes Inc
L1 L2 = CMP-06042-011831-1: Shielded Wirewound Inductor 15uH 20% 3500mA 0.0528Ω SMD; Core Material: Ferrite; DC Resistance (DCR): 52.8mR; Current Rating: 3.5A; Saturation Current: 3.3A; Test Frequency: 100kHz; Inductance: 15uH; Packaging: Tape and Reel; Width: 0.315inch; Shielding: Shielded; Number of Pins: 2; Tolerance: 20%; Mount: Surface Mount; Resistor Type: Wirewound; Case/Package: SMD/SMT; Max DC Current: 3.5A; Length: 0.315inch; Height - Seated (Max): 0.177inch
Q3 Q4 = CMP-32901-000043-2: MOSFET P-CH 55V 11A DPAK; Power Dissipation: 38W; Rds On Max: 175mR; Drain to Source Breakdown Voltage: -55V; Turn-On Delay Time: 13ns; Threshold Voltage: -4V; Turn-Off Delay Time: 23ns; Rise Time: 55ns; Gate to Source Voltage (Vgs): 20V; Input Capacitance: 350pF; Max Operating Temperature: 150°C; Mount: Surface Mount; Contact Plating: Tin; Max Power Dissipation: 38W; Width: 0.245inch; RoHS Compliant: Yes; Lead Free: Contains Lead; REACH SVHC: No SVHC; Drain to Source Resistance: 175mR; Packaging: Tape and Reel; Halogen Free: Halogen Free; Continuous Drain Current (ID): 11A; Max Dual Supply Voltage: -55V; Number of Pins: 3; Height: 0.094inch; Min Operating Temperature: -55°C; Case/Package: TO-252-3; Drain to Source Voltage (Vdss): -55V
R23 R26 = CMP-26527-007599-1: RES 182K OHM 1% 1/10W 0603; Resistance: 182kR; Power Rating: 100mW; Temperature Coefficient: 100ppm/°C; Lead Free: Lead Free; Series: RMCF; Min Operating Temperature: -55°C; Features: Automotive AEC-Q200; Length: 0.061inch; Resistor Type: Thick Film; Case Code (Metric): 1608; Packaging: Tape and Reel; Tolerance: 1%; Height: 0.022inch; Package Quantity: 1; Contact Plating: Tin; RoHS Compliant: Yes; Size Code: 0603; Max Power Dissipation: 100mW; Number of Terminations: 2; Width: 0.031inch; Max Operating Temperature: 155°C; Radiation Hardening: No; Case/Package: 0603; Case Code (Imperial): 0603; Ratings: AEC-Q200; Mount: Surface Mount
R24 R27 = CMP-2000-00041-1: Manufacturer: Panasonic; Part Number: ERA3AEB333V
R25 = CMP-2000-00318-1: Manufacturer: Panasonic; Part Number: ERJ-3EKF2002V
R28 = CMP-2000-03860-1: Manufacturer: Vishay Dale; Part Number: CRCW060311K0FKEA
R_sense_3v3 R_sense_5V = CMP-2001-03155-1: Manufacturer: Susumu; Part Number: RL1220S-R15-F
U7 U8 = CMP-0069-01740-3: Hysteretic PFET Buck Controller with Enable Pin, 8-pin MSOP, Pb-Free; Manufacturer: Texas Instruments; PowerWise: N; CompType: Switcher; PackageTopMarking: ZXTT*SKSB; PinCount: 8; ComponentLink1URL: http://www.ti.com/general/docs/lit/getliterature.tsp?genericPartNumber=LM3489&fileType=pdf; PackageDescription: MINI SOIC, .118 x .118 x .034in, 8 Lead, .0256in Pitch; Code_JEDEC: MO-187-AA; ComponentLink1Description: Datasheet URL; RoHS: Y; PackageReference: DGK0008A

## Sheet Ribbon_Connector_IO.SchDoc
size A4; SheetNumber: 4; SheetTotal: 5
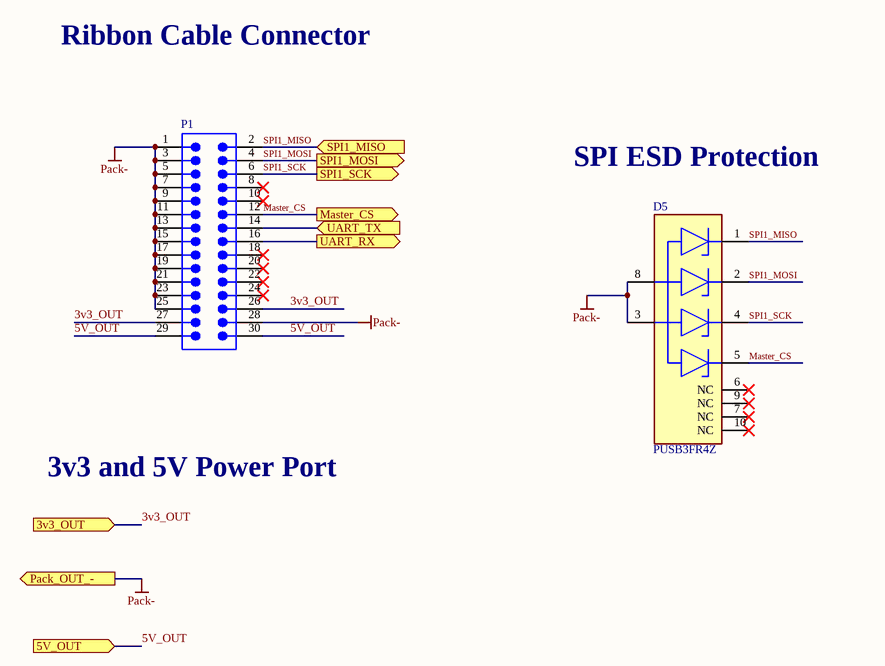
[diagram p3: Ribbon_Connector_IO.SchDoc]

### Parts
D5  PUSB3FR4Z  [FP-SOT1176-1-MFG]
P1  62703021721  [62703021721]  (value not drawn)

### Ports
3v3_OUT (in), 5V_OUT (in), Master_CS (out), Pack_OUT_- (out), SPI1_MISO (in), SPI1_MOSI (out), SPI1_SCK (out), UART_RX (out), UART_TX (in)

### Nets
Pack-: D5.3(GND) D5.8(GND) P1.1 P1.3 P1.5 P1.7 P1.9 P1.11 P1.13 P1.15 P1.17 P1.19 P1.21 P1.23 P1.25 P1.28 ; port Pack_OUT_-
3v3_OUT: P1.26 P1.27 ; port 3v3_OUT
5V_OUT: P1.29 P1.30 ; port 5V_OUT
Master_CS: D5.5(CH4) P1.12 ; port Master_CS
SPI1_MISO: D5.1(CH1) P1.2 ; port SPI1_MISO
SPI1_MOSI: D5.2(CH2) P1.4 ; port SPI1_MOSI
SPI1_SCK: D5.4(CH3) P1.6 ; port SPI1_SCK  [project net SPI1_CLK]
UART_RX: P1.16 ; port UART_RX
UART_TX: P1.14 ; port UART_TX

Not connected (* = marked no-connect by the designer): D5 6(NC)* 7(NC)* 9(NC)* 10(NC)*; P1 8* 10* 18* 20* 22* 24*

### Notes on the sheet
- Ribbon Cable Connector
- SPI ESD Protection
- 3v3 and 5V Power Port

### Library data of the parts
D5 = CMP-14432-000005-1: TVS DIODE 3.3VWM 3VC DFN2510A-10; RoHS Compliant: Yes
P1 = CMP-03913-122639960-1: 62703021721 Conn, R/A Header, 30Pos, 2Row, 1.27Mm Rohs Compliant: Yes; Insulation Resistance: 1GΩ; Current Rating: 1A; Number of Pins: 30; Length: 23.82mm; Pitch: 1.27mm; Max Operating Temperature: 105°C; NexarPartId: 122639960; RoHS: Compliant; Min Operating Temperature: -40°C

## Sheet USB.SchDoc
size A4; SheetNumber: 5; SheetTotal: 5
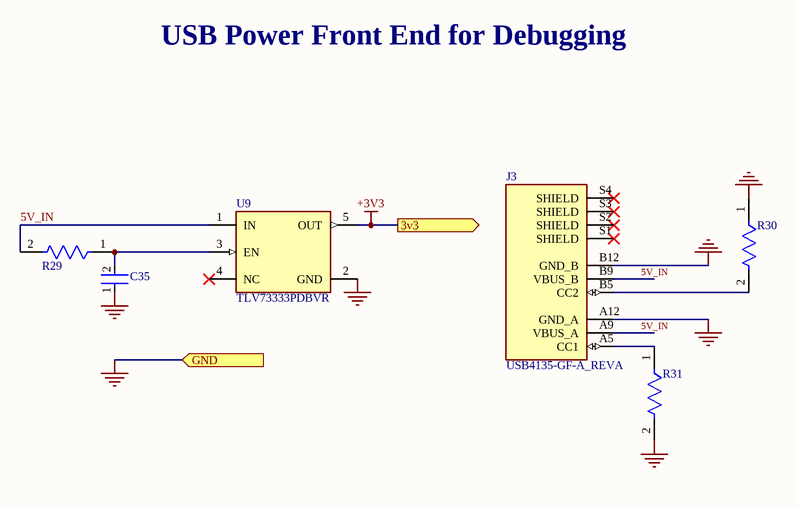
[diagram p4: USB.SchDoc]

### Parts
C35  C1608X5R1H105K080AB  [FP-C1608-080-0_1-IPC_B]  (value not drawn)
J3  USB4135-GF-A_REVA  [GCT_USB4135-GF-A_REVA]
R29  RC0603FR-0710KL  [FP-RC0603-0_55-IPC_C]  (value not drawn)
R30  CRCW06035K10FKEA  [FP-CRCW0603-e3-IPC_C]  (value not drawn)
R31  CRCW06035K10FKEA  [FP-CRCW0603-e3-IPC_C]  (value not drawn)
U9  TLV73333PDBVR  [FP-DBV0005A-MFG]

### Ports
3v3 (out), GND (in)

### Nets
+3V3: U9.5(OUT) ; port 3v3
GND: C35.1 J3.A12(GND_A) J3.B12(GND_B) R30.1 R31.2 U9.2(GND) ; port GND
5V_IN: J3.A9(VBUS_A) J3.B9(VBUS_B) R29.2 U9.1(IN)
NetC35_2: C35.2 R29.1 U9.3(EN)
NetJ3_A5: J3.A5(CC1) R31.1
NetJ3_B5: J3.B5(CC2) R30.2

Not connected (* = marked no-connect by the designer): J3 S1(SHIELD)* S2(SHIELD)* S3(SHIELD)* S4(SHIELD)*; U9 4(NC)*

### Notes on the sheet
- USB Power Front End for Debugging

### Library data of the parts
C35 = CMP-2000-06025-2: as C4 on sheet BMS_Rocket; Lead Free: Lead Free; Height: 0.8mm; Mount: Surface Mount; Radiation Hardening: No; Thickness: 0.035inch; Length: 1.6mm; Max Operating Temperature: 85°C; REACH SVHC: No SVHC; Min Operating Temperature: -55°C; Construction: Flat; RoHS Compliant: Yes; Voltage Rating: 50V; Dielectric: X5R; Packaging: Tape and Reel; Termination: SMD/SMT; Voltage Rating (DC): 50V; Case Code (Imperial): 0603; Voltage: 50V; Width: 0.031inch; Weight: 7.1E-05oz; Depth: 0.8mm; Case Code (Metric): 1608; Series: C; Case/Package: 0603; Tolerance: 10%; Resistor Type: Ceramic; Number of Pins: 2; Dielectric Material: Ceramic; Package Quantity: 1
J3 = USB4135-GF-A_REVA: USB CONN, TYPE C, R/A RCPT, 6POS, SMT; USB Connector Type:USB Type C; USB Standard:-; Gender:Receptacle; No. of Positions:6Positions; Connector Mounting:Surface Mount; Orientation:Right Angle; Contact 26AK7776; MF: Global Connector Technology; MP: USB4135GFA; SnapEDA_Link: https://www.snapeda.com/parts/USB4135GFA/Global+Connector+Technology/view-part/?ref=snap; Package: None; Value: *; Check_prices: https://www.snapeda.com/parts/USB4135GFA/Global+Connector+Technology/view-part/?ref=eda
R29 = CMP-2100-03664-2: as R1 on sheet BMS_Rocket; Depth: 0.8mm; Termination: SMD/SMT; Resistor Type: Thick Film; Series: RC; Construction: Rectangular; Features: Moisture Resistant; Packaging: Tape and Reel; Min Operating Temperature: -55°C; Number of Terminations: 2; Lead Pitch: 0.3mm; RoHS Compliant: Yes; Case/Package: 0603; Resistance Tolerance: 1%; Military Standard: Not; Weight: 7.1E-05oz; Number of Pins: 2; Tolerance: 1%; Length: 1.6mm; Case Code (Imperial): 0603; Lead Free: Lead Free; Width: 0.8mm; Max Power Dissipation: 100mW; Height: 0.45mm; Max Operating Temperature: 155°C; Case Code (Metric): 1608; Size Code: 0603
R30 R31 = CMP-1012-00590-3: RES Thick Film, 5.1kΩ, 1%, 0.1W, 100ppm/°C, 0603; Power Rating: 100mW; Voltage Rating (DC): 75V; Resistance: 5.1kR; Width: 0.85mm; Depth: 0.85mm; Military Standard: Not; Package Quantity: 5000; Case Code (Metric): 1608; Length: 1.55mm; Weight: 7.1E-05oz; Packaging: Tape and Reel; Temperature Coefficient: 100ppm/°C; Case Code (Imperial): 0603; Lead Free: Lead Free; Radiation Hardening: No; Contact Plating: Tin; Composition: Thick Film; Max Operating Temperature: 155°C; Termination: SMD/SMT; Case/Package: 0603; Min Operating Temperature: -55°C; Tolerance: 1%; Voltage Rating: 75V; Mount: Surface Mount; Height: 0.45mm
U9 = CMP-04917-000053-1: IC REG LINEAR 3.3V 300MA SOT23-5; Manufacturer: Texas Instruments; Max Junction Temp: +125°C; Accuracy Percentage: 1%; Min Supply Voltage: 1.4V; Number Of Outputs: 1; Dropout Voltage: 125mV; Nominal Supply Current: 34uA; Max Supply Voltage: 5.5V; Output Type: Fixed; Standoff Height: 0mm; Digikey Description: IC REG LINEAR 3.3V 300MA SOT23-5; Manufacturer Part Number: TLV73333PDBVR; Temperature Range High: +125°C; Temperature: -40°C to +125°C; Output Current: 300mA; Mouser Description: LDO Voltage Regulators Capacitr-Free 300-mA 5-SOT-23 -40 to 125; Automotive: No; Height: 1.45mm; Device Class L3: Voltage Regulators - Linear; ComponentLink2Description: Datasheet; Device Class L1: Integrated Circuits (ICs); ComponentLink2URL: http://www.ti.com/lit/ds/symlink/tlv733p.pdf; Octopart: https://octopart.com/tlv73333pdbvr-texas+instruments-51080890; Temperature Range Low: -40°C; RoHS: TRUE; Lead Free: Yes; Output Voltage: 3.3V; Package: DBV0005A; Device Class L2: Power Management ICs; Category: IC

## Nets that join several sheets
+3V3: BMS_Rocket (23 pins), USB (U9.5)
GND: BMS_Rocket (43 pins), USB (6 pins)
Pack-: BMS_Rocket (R13.1 R19.2 R_sense.2), Buck_Converter (16 pins), Ribbon_Connector_IO (16 pins)
VIN: BMS_Rocket (U2.4), Buck_Converter (14 pins)
3v3_OUT: Buck_Converter (5 pins), Ribbon_Connector_IO (P1.26 P1.27)
5V_OUT: Buck_Converter (5 pins), Ribbon_Connector_IO (P1.29 P1.30)
Master_CS: BMS_Rocket (U3.28), Ribbon_Connector_IO (D5.5 P1.12)
SPI1_CLK: BMS_Rocket (U3.11), Ribbon_Connector_IO (D5.4 P1.6)
SPI1_MISO: BMS_Rocket (U3.12), Ribbon_Connector_IO (D5.1 P1.2)
SPI1_MOSI: BMS_Rocket (U3.13), Ribbon_Connector_IO (D5.2 P1.4)
UART_RX: BMS_Rocket (J2.1 U3.30), Ribbon_Connector_IO (P1.16)
UART_TX: BMS_Rocket (J2.2 U3.29), Ribbon_Connector_IO (P1.14)

## Assembly variants
var_1: not fitted C7 C8 R? U2